# EAGLE schematic ftdi_decoupling (EAGLE 8.6.0)
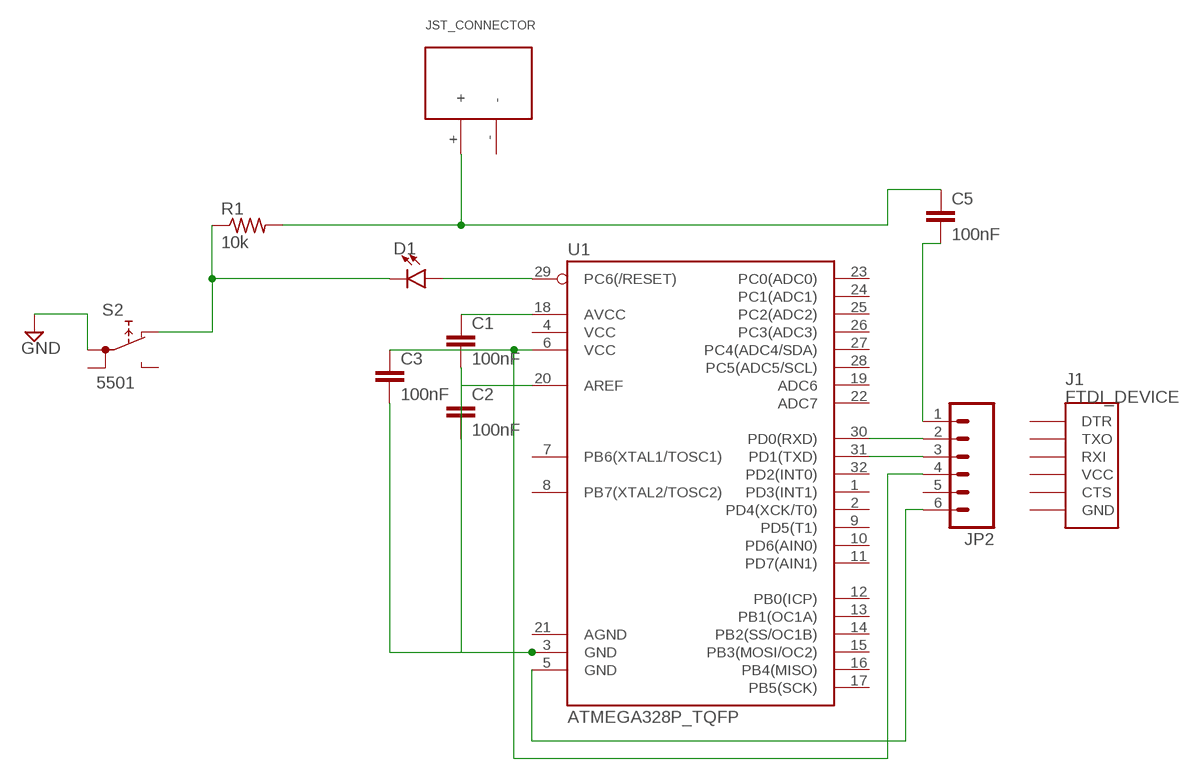
[diagram p0: schematic, sheet 1]

## Parts
C1  100nF  C-EUC0603  [C0603]
C2  100nF  C-EUC0603  [C0603]
C3  100nF  C-EUC0603  [C0603]
C5  100nF  C-EUC0603  [C0603]
D1  LED0603  [LED-0603]
J1  FTDI_DEVICE  [FTDI_DEVICE_SIDE]
JP2  M06SMD-FEMALE-V2  [1X06-SMD-FEMALE-V2]
R1  10k  R-US_R0603  [R0603]
S2  5501  [5501]
U1  ATMEGA328P_TQFP  [TQFP32-08]
U$1  JST_CONNECTOR_FEMALE  [JST_CONNECTOR_FEMALE]

## Nets
GND: S2.1A
N$1: C1.1 U1.18(AVCC)
N$2: C2.1 U1.20(AREF)
N$3: JP2.2 U1.30(PD0(RXD))
N$4: JP2.3 U1.31(PD1(TXD))
N$7: C1.2 C2.2 C3.2 U1.3(GND)
N$9: JP2.6 U1.5(GND)
N$10: C5.2 JP2.1
N$11: C5.1 R1.2 U$1.+
N$12: D1.A U1.29(PC6(/RESET))
N$13: D1.C R1.1 S2.NC
N$16: C3.1 JP2.4 U1.6(VCC)
Unconnected: J1.P$1(DTR) J1.P$2(TXO) J1.P$3(RXI) J1.P$4(VCC) J1.P$5(CTS) J1.P$6(GND) JP2.5 S2.1B S2.NO U1.1(PD3(INT1)) U1.2(PD4(XCK/T0)) U1.4(VCC) U1.7(PB6(XTAL1/TOSC1)) U1.8(PB7(XTAL2/TOSC2)) U1.9(PD5(T1)) U1.10(PD6(AIN0)) U1.11(PD7(AIN1)) U1.12(PB0(ICP)) U1.13(PB1(OC1A)) U1.14(PB2(SS/OC1B)) U1.15(PB3(MOSI/OC2)) U1.16(PB4(MISO)) U1.17(PB5(SCK)) U1.19(ADC6) U1.21(AGND) U1.22(ADC7) U1.23(PC0(ADC0)) U1.24(PC1(ADC1)) U1.25(PC2(ADC2)) U1.26(PC3(ADC3)) U1.27(PC4(ADC4/SDA)) U1.28(PC5(ADC5/SCL)) U1.32(PD2(INT0)) U$1.-

## Library data of the parts
C1-C3 C5 = rcl:C-EU: CAPACITOR, European symbol; SPICEPREFIX: C
D1 = SparkFun-LED:LED: LED (Generic) Standard schematic elements and footprints for 5mm, 3mm, 1206, and 0603 sized LEDs. Generic LEDs with no color specified.
J1 = quad:FTDI_DEVICE: Connector which mates to FTDI basic or FTDI cable.
JP2 = SparkFun:M06: Header 6 Standard 6-pin 0.1" header. Use with straight break away headers (SKU : PRT-00116), right angle break away headers (PRT-00553), swiss pins (PRT-00743), machine pins (PRT-00117), and female headers (PRT-00115). Molex polarized connector foot print use with SKU : PRT-08094 with associated crimp pins and housings. NOTES ON THE VARIANTS LOCK and LOCK_LONGPADS... This footprint was designed to help hold the alignment of a through-hole component (i.e. 6-pin header) while soldering it into place. You may notice that each hole has been shifted either up or down by 0.005 of an inch from it's more standard position (which is a perfectly straight line). This slight alteration caused the pins (the squares in the middle) to touch the edges of the holes. Because they are alternating, it causes a "brace" to hold the component in place. 0.005 has proven to be the perfect amount of "off-center" position when using our standard breakaway headers. Although looks a little odd when you look at the bare footprint, once you have a header in there, the alteration is very hard to notice. Also, if you push a header all the way into place, it is covered up entirely on the bottom side. This idea of altering the position of holes to aid alignment will be further integrated into the Sparkfun Library for other footprints. It can help hold any component with 3 or more connection pins.
R1 = resistor:R-US_: RESISTOR, American symbol
S2 = switch:55?: PUSHBUTTON SERIES 5500 SWITCHES Source: www.e-switch.com .. 5500.pdf
U1 = quad:ATMEGA328P_TQFP; PROD_ID: IC-09069
U$1 = quad:JST_CONNECTOR_FEMALE